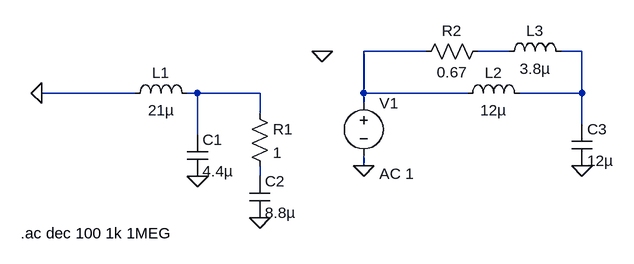
[diagram p0: schematic AC_stuff.asc]
AC_stuff.asc, the LTspice schematic file:
Version 4
SHEET 1 992 680
WIRE 560 48 464 48
WIRE 688 48 640 48
WIRE 800 48 768 48
WIRE 112 112 -32 112
WIRE 208 112 192 112
WIRE 304 112 208 112
WIRE 464 112 464 48
WIRE 624 112 464 112
WIRE 800 112 800 48
WIRE 800 112 704 112
WIRE 464 128 464 112
WIRE 304 144 304 112
WIRE 800 160 800 112
WIRE 208 176 208 112
WIRE 464 224 464 208
WIRE 304 240 304 224
FLAG 208 240 0
FLAG 304 304 0
FLAG 464 224 0
FLAG -32 112 0
FLAG 800 224 0
FLAG 400 48 0
SYMBOL ind 96 128 R270
WINDOW 0 32 56 VTop 2
WINDOW 3 5 56 VBottom 2
SYMATTR InstName L1
SYMATTR Value 21µ
SYMATTR SpiceLine Rser=15m
SYMBOL cap 192 176 R0
SYMATTR InstName C1
SYMATTR Value 4.4µ
SYMBOL cap 288 240 R0
SYMATTR InstName C2
SYMATTR Value 8.8µ
SYMBOL res 288 128 R0
SYMATTR InstName R1
SYMATTR Value 1
SYMBOL voltage 464 112 R0
WINDOW 123 24 124 Left 2
WINDOW 39 0 0 Left 2
SYMATTR Value2 AC 1
SYMATTR InstName V1
SYMATTR Value ""
SYMBOL ind 608 128 R270
WINDOW 0 32 56 VTop 2
WINDOW 3 5 56 VBottom 2
SYMATTR InstName L2
SYMATTR Value 12µ
SYMBOL cap 784 160 R0
SYMATTR InstName C3
SYMATTR Value 12µ
SYMBOL ind 672 64 R270
WINDOW 0 32 56 VTop 2
WINDOW 3 5 56 VBottom 2
SYMATTR InstName L3
SYMATTR Value 3.8µ
SYMBOL res 656 32 R90
WINDOW 0 0 56 VBottom 2
WINDOW 3 32 56 VTop 2
SYMATTR InstName R2
SYMATTR Value 0.67
TEXT -64 328 Left 2 !.ac dec 100 1k 1MEG

The netlist it stands for:
* AC_stuff.asc
L1 0 N004 21µ Rser=15m
C1 N004 0 4.4µ
C2 N005 0 8.8µ
R1 N004 N005 1
V1 N001 0 AC 1
L2 N001 N003 12µ
C3 N003 0 12µ
L3 N002 N003 3.8µ
R2 N002 N001 0.67
.ac dec 100 1k 1MEG
.backanno
.end